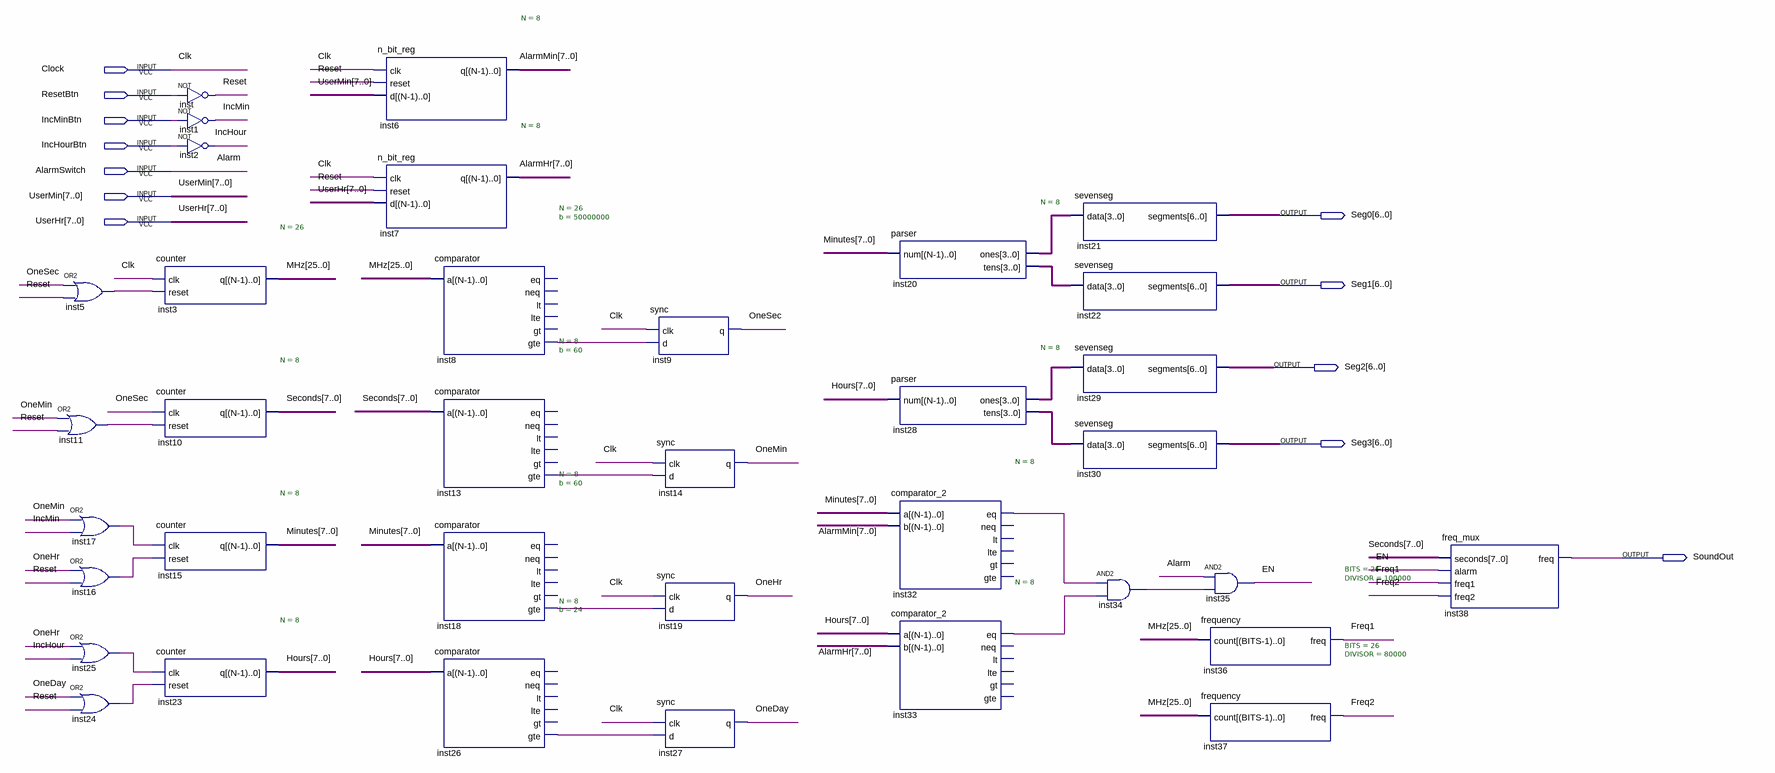
[diagram p0: schematic sheet]
// Quartus schematic Main_Diagram.bdf as structural Verilog: 36 symbols, 12 pins
module Main_Diagram (
  input  Clock,
  input  ResetBtn,
  input  IncMinBtn,
  input  IncHourBtn,
  input  AlarmSwitch,
  input  [7:0] UserMin,
  input  [7:0] UserHr,
  output [6:0] Seg0,
  output [6:0] Seg1,
  output [6:0] Seg2,
  output [6:0] Seg3,
  output SoundOut
);

  wire EN, Freq1, Freq2, IncHour, IncMin, inst5_out, inst8_gte, inst11_out, inst13_gte, inst16_out,
       inst17_out, inst18_gte, inst24_out, inst25_out, inst26_gte, inst32_eq, inst33_eq, inst34_out, OneDay,
       OneHr, OneMin, OneSec, Reset;
  wire [3:0] inst20_ones, inst20_tens, inst28_ones, inst28_tens;
  wire [7:0] AlarmHr, AlarmMin, Hours, Minutes, Seconds;
  wire [25:0] MHz;

  or inst5 (inst5_out, OneSec, Reset);
  or inst11 (inst11_out, OneMin, Reset);
  or inst17 (inst17_out, OneMin, IncMin);
  or inst16 (inst16_out, OneHr, Reset);
  or inst25 (inst25_out, OneHr, IncHour);
  or inst24 (inst24_out, OneDay, Reset);
  counter #(.N(26)) inst3 (.clk(Clock), .reset(inst5_out), .q(MHz));
  counter #(.N(8)) inst10 (.clk(OneSec), .reset(inst11_out), .q(Seconds));
  counter #(.N(8)) inst15 (.clk(inst17_out), .reset(inst16_out), .q(Minutes));
  counter #(.N(8)) inst23 (.clk(inst25_out), .reset(inst24_out), .q(Hours));
  not inst (Reset, ResetBtn);
  not inst1 (IncMin, IncMinBtn);
  not inst2 (IncHour, IncHourBtn);
  n_bit_reg #(.N(8)) inst6 (.clk(Clock), .reset(Reset), .d(UserMin), .q(AlarmMin));
  n_bit_reg #(.N(8)) inst7 (.clk(Clock), .reset(Reset), .d(UserHr), .q(AlarmHr));
  comparator #(.N(26), .b(50000000)) inst8 (.a(MHz), .gte(inst8_gte));  // open: eq, neq, lt, lte, gt
  comparator #(.N(8), .b(60)) inst13 (.a(Seconds), .gte(inst13_gte));  // open: eq, neq, lt, lte, gt
  comparator #(.N(8), .b(60)) inst18 (.a(Minutes), .gte(inst18_gte));  // open: eq, neq, lt, lte, gt
  comparator #(.N(8), .b(24)) inst26 (.a(Hours), .gte(inst26_gte));  // open: eq, neq, lt, lte, gt
  sync inst9 (.clk(Clock), .d(inst8_gte), .q(OneSec));
  sync inst14 (.clk(Clock), .d(inst13_gte), .q(OneMin));
  sync inst19 (.clk(Clock), .d(inst18_gte), .q(OneHr));
  sync inst27 (.clk(Clock), .d(inst26_gte), .q(OneDay));
  parser #(.N(8)) inst20 (.num(Minutes), .ones(inst20_ones), .tens(inst20_tens));
  parser #(.N(8)) inst28 (.num(Hours), .ones(inst28_ones), .tens(inst28_tens));
  comparator_2 #(.N(8)) inst32 (.a(Minutes), .b(AlarmMin), .eq(inst32_eq));  // open: neq, lt, lte, gt, gte
  comparator_2 #(.N(8)) inst33 (.a(Hours), .b(AlarmHr), .eq(inst33_eq));  // open: neq, lt, lte, gt, gte
  sevenseg inst21 (.data(inst20_ones), .segments(Seg0));
  sevenseg inst22 (.data(inst20_tens), .segments(Seg1));
  sevenseg inst29 (.data(inst28_ones), .segments(Seg2));
  sevenseg inst30 (.data(inst28_tens), .segments(Seg3));
  and inst34 (inst34_out, inst32_eq, inst33_eq);
  and inst35 (EN, AlarmSwitch, inst34_out);
  frequency #(.BITS(26), .DIVISOR(100000)) inst36 (.count(MHz), .freq(Freq1));
  frequency #(.BITS(26), .DIVISOR(80000)) inst37 (.count(MHz), .freq(Freq2));
  freq_mux inst38 (.seconds(Seconds), .alarm(EN), .freq1(Freq1), .freq2(Freq2), .freq(SoundOut));

  // Other names for the same wires on the sheet: Alarm = AlarmSwitch; Clk = Clock
endmodule
